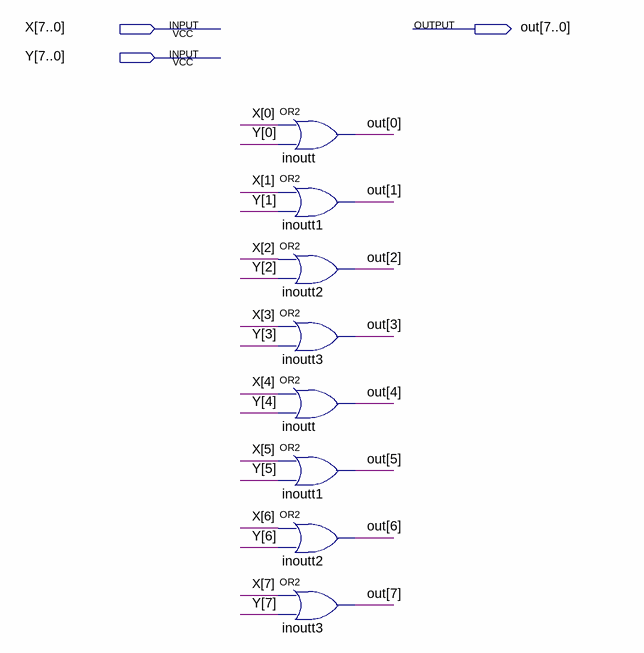
[diagram p0: schematic sheet]
// Quartus schematic OR.bdf as structural Verilog: 8 symbols, 3 pins
module OR (
  input  [7:0] X,
  input  [7:0] Y,
  output [7:0] out
);

  or inoutt (out[0], X[0], Y[0]);
  or inoutt1 (out[1], X[1], Y[1]);
  or inoutt2 (out[2], X[2], Y[2]);
  or inoutt3 (out[3], X[3], Y[3]);
  or inoutt_dup2 (out[4], X[4], Y[4]);
  or inoutt1_dup2 (out[5], X[5], Y[5]);
  or inoutt2_dup2 (out[6], X[6], Y[6]);
  or inoutt3_dup2 (out[7], X[7], Y[7]);
endmodule
